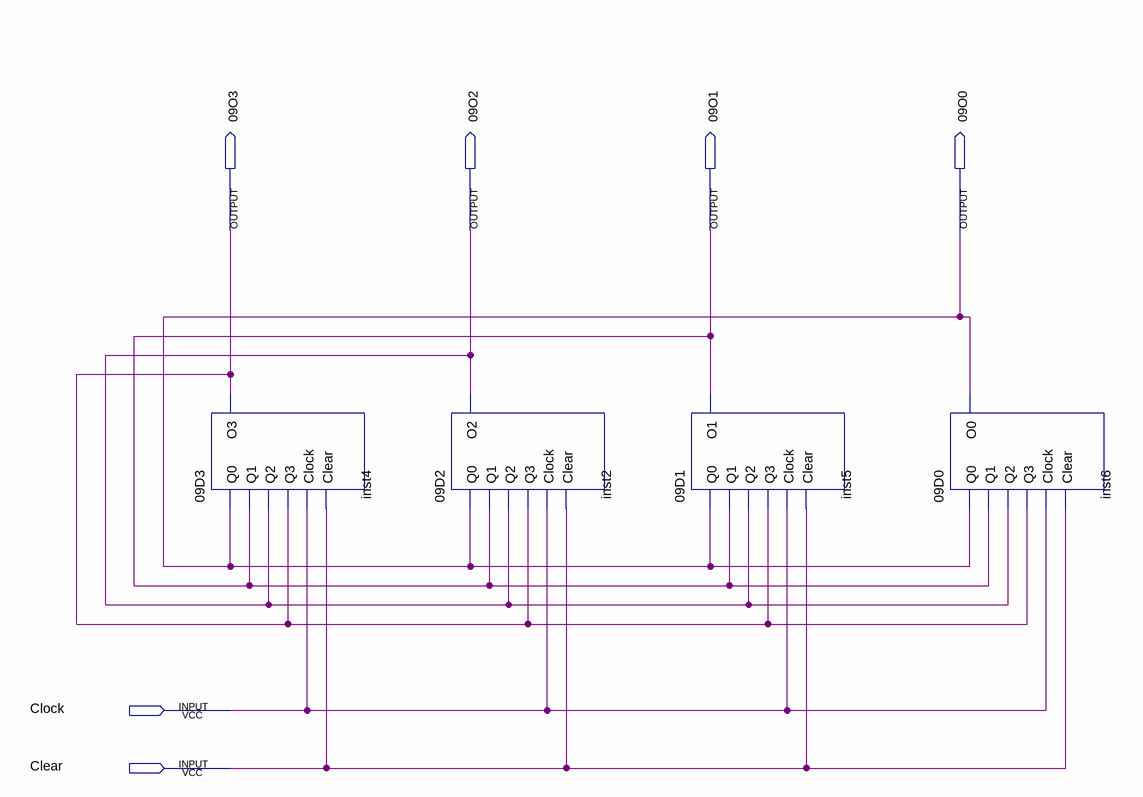
[diagram p0: schematic sheet]
// Quartus schematic Contador09.bdf as structural Verilog: 4 symbols, 6 pins
module Contador09 (
  input  Clock,
  input  Clear,
  output \09O3 ,
  output \09O2 ,
  output \09O1 ,
  output \09O0 
);

  \09D3  inst4 (.Q0(\09O0 ), .Q1(\09O1 ), .Q2(\09O2 ), .Q3(\09O3 ), .Clock(Clock), .Clear(Clear), .O3(\09O3 ));
  \09D2  inst2 (.Q0(\09O0 ), .Q1(\09O1 ), .Q2(\09O2 ), .Q3(\09O3 ), .Clock(Clock), .Clear(Clear), .O2(\09O2 ));
  \09D1  inst5 (.Q0(\09O0 ), .Q1(\09O1 ), .Q2(\09O2 ), .Q3(\09O3 ), .Clock(Clock), .Clear(Clear), .O1(\09O1 ));
  \09D0  inst6 (.Q0(\09O0 ), .Q1(\09O1 ), .Q2(\09O2 ), .Q3(\09O3 ), .Clock(Clock), .Clear(Clear), .O0(\09O0 ));
endmodule
